# Altium schematic sheet FPGA-Connector.SchDoc
size A2; Date: Date; CompanyName: HESSO; Engineer: Name; Address1: Route du Rawyl 47; Address2: 1950 Sion; Address3: Switzerland; ProjectName: Project Name
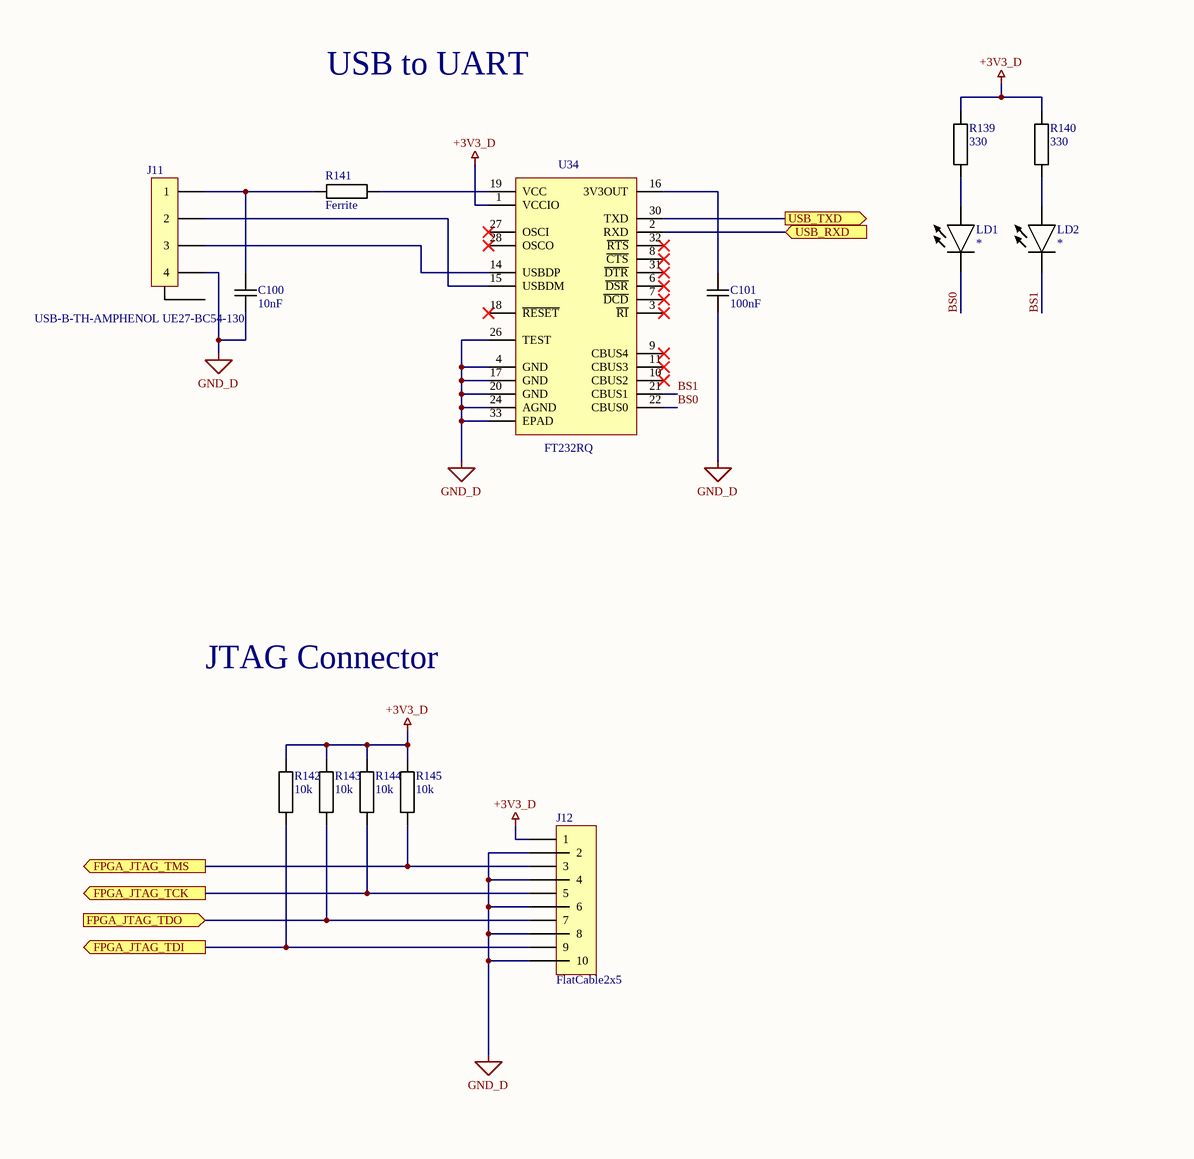
[diagram p0: FPGA-Connector.SchDoc, left]
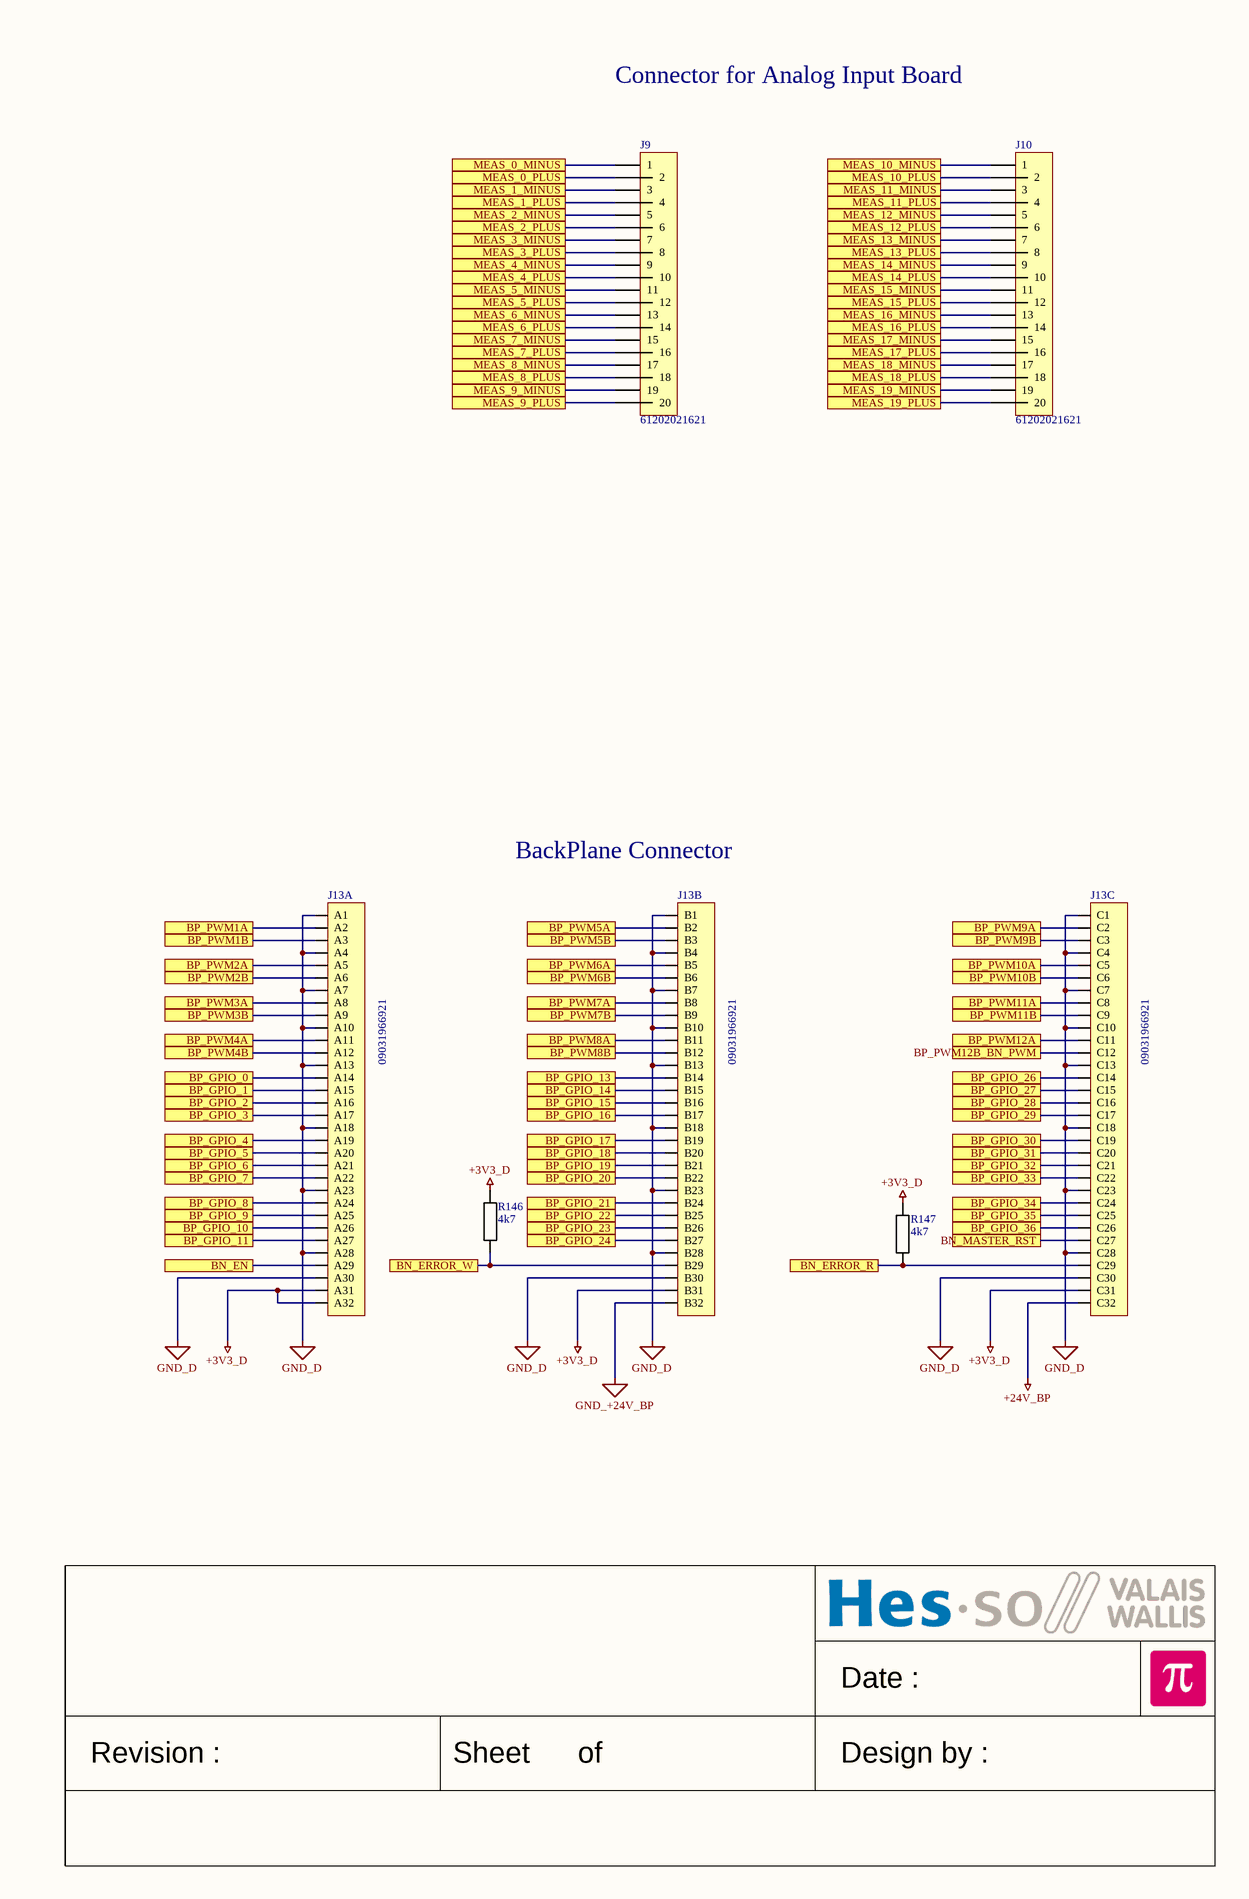
[diagram p1: FPGA-Connector.SchDoc, right]

## Parts
C100  10nF  [CAPACITOR 1608 REFLOW]
C101  100nF  [CAPACITOR 1608 REFLOW]
J9  61202021621  [FlatCable2x10 2.54MM Straight TH]
J10  61202021621  [FlatCable2x10 2.54MM Straight TH]
J11  USB-B-TH-AMPHENOL UE27-BC54-130  [USB-B TH AMPHENOL UE27-BC54-130]
J12  FlatCable2x5  [FlatCable2x5 2MM Straight TH FCI 98414-G06-10ULF]
J13  09031966921  [DIN41612 MALE 3X32 ABC R90]  (parts A,B,C of 3)
LD1  *  [LED 1608 REFLOW]
LD2  *  [LED 1608 REFLOW]
R139  330  [RESISTOR 2012 REFLOW]
R140  330  [RESISTOR 2012 REFLOW]
R141  Ferrite  [RESISTOR 1608 REFLOW]
R142  10k  [RESISTOR 1608 REFLOW]
R143  10k  [RESISTOR 1608 REFLOW]
R144  10k  [RESISTOR 1608 REFLOW]
R145  10k  [RESISTOR 1608 REFLOW]
R146  4k7  [RESISTOR 1608 REFLOW]
R147  4k7  [RESISTOR 1608 REFLOW]
U34  FT232RQ  [QFN32 P0.5 T3.2x3.2 C5.0X5.0 H1.0]

## Ports
BN_EN, BN_ERROR_R, BN_ERROR_W, BN_MASTER_RST, BP_GPIO_0, BP_GPIO_1, BP_GPIO_2, BP_GPIO_3, BP_GPIO_4, BP_GPIO_5, BP_GPIO_6, BP_GPIO_7, BP_GPIO_8, BP_GPIO_9, BP_GPIO_10, BP_GPIO_11, BP_GPIO_13, BP_GPIO_14, BP_GPIO_15, BP_GPIO_16, BP_GPIO_17, BP_GPIO_18, BP_GPIO_19, BP_GPIO_20, BP_GPIO_21, BP_GPIO_22, BP_GPIO_23, BP_GPIO_24, BP_GPIO_26, BP_GPIO_27, BP_GPIO_28, BP_GPIO_29, BP_GPIO_30, BP_GPIO_31, BP_GPIO_32, BP_GPIO_33, BP_GPIO_34, BP_GPIO_35, BP_GPIO_36, BP_PWM1A, BP_PWM1B, BP_PWM2A, BP_PWM2B, BP_PWM3A, BP_PWM3B, BP_PWM4A, BP_PWM4B, BP_PWM5A, BP_PWM5B, BP_PWM6A, BP_PWM6B, BP_PWM7A, BP_PWM7B, BP_PWM8A, BP_PWM8B, BP_PWM9A, BP_PWM9B, BP_PWM10A, BP_PWM10B, BP_PWM11A, BP_PWM11B, BP_PWM12A, BP_PWM12B_BN_PWM, FPGA_JTAG_TCK (out), FPGA_JTAG_TDI (out), FPGA_JTAG_TDO (in), FPGA_JTAG_TMS (out), MEAS_0_MINUS, MEAS_0_PLUS, MEAS_1_MINUS, MEAS_1_PLUS, MEAS_2_MINUS, MEAS_2_PLUS, MEAS_3_MINUS, MEAS_3_PLUS, MEAS_4_MINUS, MEAS_4_PLUS, MEAS_5_MINUS, MEAS_5_PLUS, MEAS_6_MINUS, MEAS_6_PLUS, MEAS_7_MINUS, MEAS_7_PLUS, MEAS_8_MINUS, MEAS_8_PLUS, MEAS_9_MINUS, MEAS_9_PLUS, MEAS_10_MINUS, MEAS_10_PLUS, MEAS_11_MINUS, MEAS_11_PLUS, MEAS_12_MINUS, MEAS_12_PLUS, MEAS_13_MINUS, MEAS_13_PLUS, MEAS_14_MINUS, MEAS_14_PLUS, MEAS_15_MINUS, MEAS_15_PLUS, MEAS_16_MINUS, MEAS_16_PLUS, MEAS_17_MINUS, MEAS_17_PLUS, MEAS_18_MINUS, MEAS_18_PLUS, MEAS_19_MINUS, MEAS_19_PLUS, USB_RXD (in), USB_TXD (out)

## Nets
+3V3_D: J12.1 J13.A31 J13.A32 J13.B31 J13.C31 R139.2 R140.2 R142.2 R143.2 R144.2 R145.2 R146.2 R147.2 U34.1(VCCIO)
+24V_BP: J13.C32
GND_+24V_BP: J13.B32
GND_D: C100.1 C101.1 J11.4 J12.2 J12.4 J12.6 J12.8 J12.10 J13.A1 J13.A4 J13.A7 J13.A10 J13.A13 J13.A18 J13.A23 J13.A28 J13.A30 J13.B1 J13.B4 J13.B7 J13.B10 J13.B13 J13.B18 J13.B23 J13.B28 J13.B30 J13.C1 J13.C4 J13.C7 J13.C10 J13.C13 J13.C18 J13.C23 J13.C28 J13.C30 U34.4(GND) U34.17(GND) U34.20(GND) U34.24(AGND) U34.26(TEST) U34.33(EPAD)
BN_EN: J13.A29 ; port BN_EN
BN_ERROR_R: J13.C29 R147.1 ; port BN_ERROR_R
BN_ERROR_W: J13.B29 R146.1 ; port BN_ERROR_W
BN_MASTER_RST: J13.C27 ; port BN_MASTER_RST
BP_GPIO_0: J13.A14 ; port BP_GPIO_0
BP_GPIO_1: J13.A15 ; port BP_GPIO_1
BP_GPIO_2: J13.A16 ; port BP_GPIO_2
BP_GPIO_3: J13.A17 ; port BP_GPIO_3
BP_GPIO_4: J13.A19 ; port BP_GPIO_4
BP_GPIO_5: J13.A20 ; port BP_GPIO_5
BP_GPIO_6: J13.A21 ; port BP_GPIO_6
BP_GPIO_7: J13.A22 ; port BP_GPIO_7
BP_GPIO_8: J13.A24 ; port BP_GPIO_8
BP_GPIO_9: J13.A25 ; port BP_GPIO_9
BP_GPIO_10: J13.A26 ; port BP_GPIO_10
BP_GPIO_11: J13.A27 ; port BP_GPIO_11
BP_GPIO_13: J13.B14 ; port BP_GPIO_13
BP_GPIO_14: J13.B15 ; port BP_GPIO_14
BP_GPIO_15: J13.B16 ; port BP_GPIO_15
BP_GPIO_16: J13.B17 ; port BP_GPIO_16
BP_GPIO_17: J13.B19 ; port BP_GPIO_17
BP_GPIO_18: J13.B20 ; port BP_GPIO_18
BP_GPIO_19: J13.B21 ; port BP_GPIO_19
BP_GPIO_20: J13.B22 ; port BP_GPIO_20
BP_GPIO_21: J13.B24 ; port BP_GPIO_21
BP_GPIO_22: J13.B25 ; port BP_GPIO_22
BP_GPIO_23: J13.B26 ; port BP_GPIO_23
BP_GPIO_24: J13.B27 ; port BP_GPIO_24
BP_GPIO_26: J13.C14 ; port BP_GPIO_26
BP_GPIO_27: J13.C15 ; port BP_GPIO_27
BP_GPIO_28: J13.C16 ; port BP_GPIO_28
BP_GPIO_29: J13.C17 ; port BP_GPIO_29
BP_GPIO_30: J13.C19 ; port BP_GPIO_30
BP_GPIO_31: J13.C20 ; port BP_GPIO_31
BP_GPIO_32: J13.C21 ; port BP_GPIO_32
BP_GPIO_33: J13.C22 ; port BP_GPIO_33
BP_GPIO_34: J13.C24 ; port BP_GPIO_34
BP_GPIO_35: J13.C25 ; port BP_GPIO_35
BP_GPIO_36: J13.C26 ; port BP_GPIO_36
BP_PWM1A: J13.A2 ; port BP_PWM1A
BP_PWM1B: J13.A3 ; port BP_PWM1B
BP_PWM2A: J13.A5 ; port BP_PWM2A
BP_PWM2B: J13.A6 ; port BP_PWM2B
BP_PWM3A: J13.A8 ; port BP_PWM3A
BP_PWM3B: J13.A9 ; port BP_PWM3B
BP_PWM4A: J13.A11 ; port BP_PWM4A
BP_PWM4B: J13.A12 ; port BP_PWM4B
BP_PWM5A: J13.B2 ; port BP_PWM5A
BP_PWM5B: J13.B3 ; port BP_PWM5B
BP_PWM6A: J13.B5 ; port BP_PWM6A
BP_PWM6B: J13.B6 ; port BP_PWM6B
BP_PWM7A: J13.B8 ; port BP_PWM7A
BP_PWM7B: J13.B9 ; port BP_PWM7B
BP_PWM8A: J13.B11 ; port BP_PWM8A
BP_PWM8B: J13.B12 ; port BP_PWM8B
BP_PWM9A: J13.C2 ; port BP_PWM9A
BP_PWM9B: J13.C3 ; port BP_PWM9B
BP_PWM10A: J13.C5 ; port BP_PWM10A
BP_PWM10B: J13.C6 ; port BP_PWM10B
BP_PWM11A: J13.C8 ; port BP_PWM11A
BP_PWM11B: J13.C9 ; port BP_PWM11B
BP_PWM12A: J13.C11 ; port BP_PWM12A
BP_PWM12B_BN_PWM: J13.C12 ; port BP_PWM12B_BN_PWM
BS0: LD1.1(C) U34.22(CBUS0)
BS1: LD2.1(C) U34.21(CBUS1)
FPGA_JTAG_TCK: J12.5 R144.1 ; port FPGA_JTAG_TCK
FPGA_JTAG_TDI: J12.9 R142.1 ; port FPGA_JTAG_TDI
FPGA_JTAG_TDO: J12.7 R143.1 ; port FPGA_JTAG_TDO
FPGA_JTAG_TMS: J12.3 R145.1 ; port FPGA_JTAG_TMS
MEAS_0_MINUS: J9.1 ; port MEAS_0_MINUS
MEAS_0_PLUS: J9.2 ; port MEAS_0_PLUS
MEAS_1_MINUS: J9.3 ; port MEAS_1_MINUS
MEAS_1_PLUS: J9.4 ; port MEAS_1_PLUS
MEAS_2_MINUS: J9.5 ; port MEAS_2_MINUS
MEAS_2_PLUS: J9.6 ; port MEAS_2_PLUS
MEAS_3_MINUS: J9.7 ; port MEAS_3_MINUS
MEAS_3_PLUS: J9.8 ; port MEAS_3_PLUS
MEAS_4_MINUS: J9.9 ; port MEAS_4_MINUS
MEAS_4_PLUS: J9.10 ; port MEAS_4_PLUS
MEAS_5_MINUS: J9.11 ; port MEAS_5_MINUS
MEAS_5_PLUS: J9.12 ; port MEAS_5_PLUS
MEAS_6_MINUS: J9.13 ; port MEAS_6_MINUS
MEAS_6_PLUS: J9.14 ; port MEAS_6_PLUS
MEAS_7_MINUS: J9.15 ; port MEAS_7_MINUS
MEAS_7_PLUS: J9.16 ; port MEAS_7_PLUS
MEAS_8_MINUS: J9.17 ; port MEAS_8_MINUS
MEAS_8_PLUS: J9.18 ; port MEAS_8_PLUS
MEAS_9_MINUS: J9.19 ; port MEAS_9_MINUS
MEAS_9_PLUS: J9.20 ; port MEAS_9_PLUS
MEAS_10_MINUS: J10.1 ; port MEAS_10_MINUS
MEAS_10_PLUS: J10.2 ; port MEAS_10_PLUS
MEAS_11_MINUS: J10.3 ; port MEAS_11_MINUS
MEAS_11_PLUS: J10.4 ; port MEAS_11_PLUS
MEAS_12_MINUS: J10.5 ; port MEAS_12_MINUS
MEAS_12_PLUS: J10.6 ; port MEAS_12_PLUS
MEAS_13_MINUS: J10.7 ; port MEAS_13_MINUS
MEAS_13_PLUS: J10.8 ; port MEAS_13_PLUS
MEAS_14_MINUS: J10.9 ; port MEAS_14_MINUS
MEAS_14_PLUS: J10.10 ; port MEAS_14_PLUS
MEAS_15_MINUS: J10.11 ; port MEAS_15_MINUS
MEAS_15_PLUS: J10.12 ; port MEAS_15_PLUS
MEAS_16_MINUS: J10.13 ; port MEAS_16_MINUS
MEAS_16_PLUS: J10.14 ; port MEAS_16_PLUS
MEAS_17_MINUS: J10.15 ; port MEAS_17_MINUS
MEAS_17_PLUS: J10.16 ; port MEAS_17_PLUS
MEAS_18_MINUS: J10.17 ; port MEAS_18_MINUS
MEAS_18_PLUS: J10.18 ; port MEAS_18_PLUS
MEAS_19_MINUS: J10.19 ; port MEAS_19_MINUS
MEAS_19_PLUS: J10.20 ; port MEAS_19_PLUS
USB_RXD: U34.2(RXD) ; port USB_RXD
USB_TXD: U34.30(TXD) ; port USB_TXD
NetC100_2: C100.2 J11.1 R141.1
NetC101_2: C101.2 U34.16(3V3OUT)
NetJ11_2: J11.2 U34.15(USBDM)
NetJ11_3: J11.3 U34.14(USBDP)
NetJ11_5: J11.5 J11.6
NetLD1_2: LD1.2(A) R139.1
NetLD2_2: LD2.2(A) R140.1
NetR141_2: R141.2 U34.19(VCC)

Not connected (* = marked no-connect by the designer): U34 3(~{RI})* 5 6(~{DSR})* 7(~{DCD})* 8(~{CTS})* 9(CBUS4)* 10(CBUS2)* 11(CBUS3)* 12 13 18(~{RESET})* 23 25 27(OSCI)* 28(OSCO)* 29 31(~{DTR})* 32(~{RTS})*

## Notes on the sheet
- USB to UART
- Connector for Analog Input Board
- JTAG Connector
- BackPlane Connector
- Date :
- Revision :
- Sheet
- of
- Design by :

## Library data of the parts
C100 C101 = Capacitor: Capacitor X7R 10% 50V 1608(0603)
  C100: Value: 10nF
  C101: Value: 100nF
J9 J10 = FlatCable2x10: Manufacturer: Wurth Elektronik; Mouser No.: 710-61202021621; Value: 61202021621
J13 = DIN41612 MALE 3X32 ABC R90: Manufacturer: Harting; Mouser No.: 617-09-03-196-6921; Value: 09031966921
LD1 LD2 = LED: LED generic; Value: *
R139 R140 = Resistor: Resistor 1% 50V 125mW 2012(0805); Value: 330
R141-R147 = Resistor: Resistor 1% 50V 100mW 1608(0603)
  R141: Value: Ferrite
  R142-R145: Value: 10k
  R146 R147: Value: 4k7
U34 = FT232RQ: 24-Bit ADC with Ultra Low Noise PGIA - Crystal; Value: FT232RQ